# Altium project PCB_LLC_simplified.PrjPcb
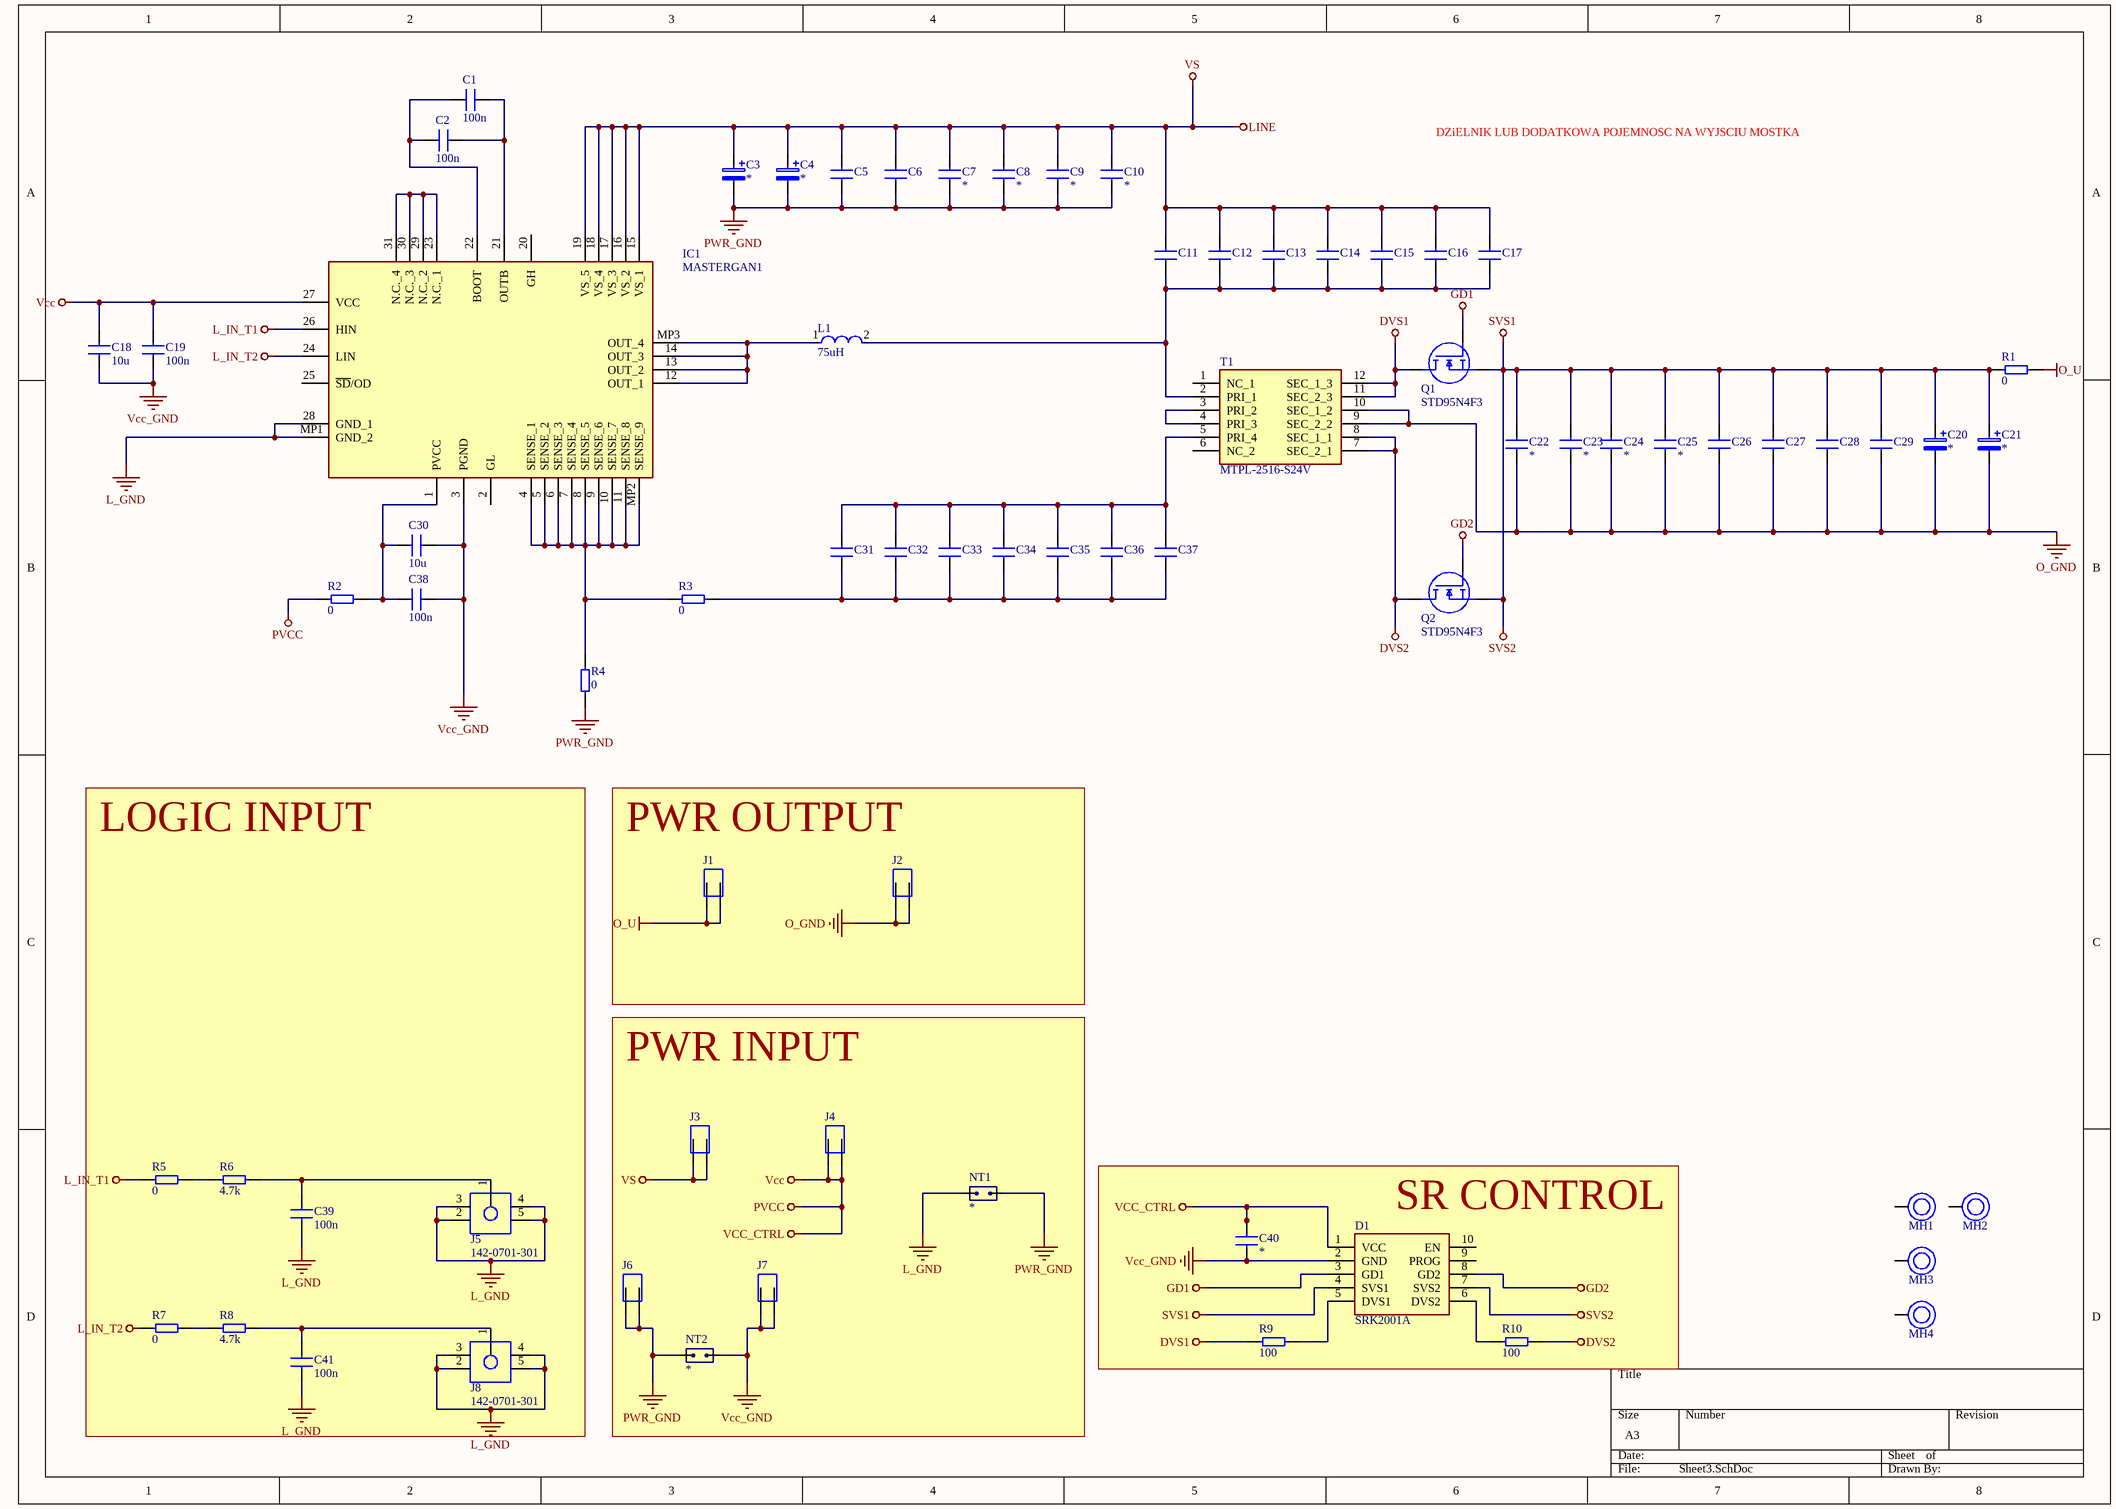
[diagram p0: Sheet3.SchDoc]
1 sheet, 71 parts. Net scope: global (net labels, ports and power ports of the same name join across sheets).
Board file: PCB1.PcbDoc

## Sheet Sheet3.SchDoc
size A3; SheetNumber: 1; SheetTotal: 1

### Parts
C1  100n  [Capcitor_1206]
C2  100n  [Capcitor_1206]
C3  *  [CAPPRD500W60D1300H2700]
C4  *  [CAPPRD500W60D1300H2700]
C5  620p  [Capcitor_1206]  (value not drawn)
C6  620p  [Capcitor_1206]  (value not drawn)
C7  *  [Capacitor_1812]
C8  *  [Capacitor_1812]
C9  *  [Capacitor_0805]
C10  *  [Capacitor_0805]
C11  620p  [Capcitor_1206]  (value not drawn)
C12  620p  [Capcitor_1206]  (value not drawn)
C13  620p  [Capcitor_1206]  (value not drawn)
C14  620p  [Capcitor_1206]  (value not drawn)
C15  620p  [Capcitor_1206]  (value not drawn)
C16  620p  [Capcitor_1206]  (value not drawn)
C17  620p  [Capcitor_1206]  (value not drawn)
C18  10u  [Capacitor_1812]
C19  100n  [Capcitor_1206]
C20  *  [Capacitor_Electrolytic_Vib_Res]
C21  *  [Capacitor_Electrolytic_Vib_Res]
C22  *  [Capacitor_0805]
C23  *  [Capacitor_0805]
C24  *  [Capacitor_0805]
C25  *  [Capacitor_0805]
C26  620p  [Capcitor_1206]  (value not drawn)
C27  620p  [Capcitor_1206]  (value not drawn)
C28  620p  [Capcitor_1206]  (value not drawn)
C29  620p  [Capcitor_1206]  (value not drawn)
C30  10u  [Capacitor_1812]
C31  620p  [Capcitor_1206]  (value not drawn)
C32  620p  [Capcitor_1206]  (value not drawn)
C33  620p  [Capcitor_1206]  (value not drawn)
C34  620p  [Capcitor_1206]  (value not drawn)
C35  620p  [Capcitor_1206]  (value not drawn)
C36  620p  [Capcitor_1206]  (value not drawn)
C37  620p  [Capcitor_1206]  (value not drawn)
C38  100n  [Capcitor_1206]
C39  100n  [Capcitor_1206]
C40  *  [Capacitor_0805]
C41  100n  [Capcitor_1206]
D1  SRK2001A  [SOIC127P600X175-8N]
IC1  MASTERGAN1  [MASTERGAN1]
J1  1289-STR  [1289STR]  (value not drawn)
J2  1289-STR  [1289STR]  (value not drawn)
J3  1289-STR  [1289STR]  (value not drawn)
J4  1289-STR  [1289STR]  (value not drawn)
J5  142-0701-301  [1420701301]
J6  1289-STR  [1289STR]  (value not drawn)
J7  1289-STR  [1289STR]  (value not drawn)
J8  142-0701-301  [1420701301]
L1  75uH  [FP-IHLP-4040ED-FP_3_175x4-MFG]
MH1  Mounting_Hole_M3  [Mounting_Hole_M3]  (value not drawn)  (no BOM)
MH2  Mounting_Hole_M3  [Mounting_Hole_M3]  (value not drawn)  (no BOM)
MH3  Mounting_Hole_M3  [Mounting_Hole_M3]  (value not drawn)  (no BOM)
MH4  Mounting_Hole_M3  [Mounting_Hole_M3]  (value not drawn)  (no BOM)
NT1  *  [Net tie]  (net tie, no BOM)
NT2  *  [Net tie]  (net tie, no BOM)
Q1  STD95N4F3  [STD95N4F3]
Q2  STD95N4F3  [STD95N4F3]
R1  0  [Resistor_1206]
R2  0  [Resistor_1206]
R3  0  [Resistor_1206]
R4  0  [Resistor_1206]
R5  0  [Resistor_1206]
R6  4.7k  [Resistor_1206]
R7  0  [Resistor_1206]
R8  4.7k  [Resistor_1206]
R9  100  [Resistor_1206]
R10  100  [Resistor_1206]
T1  MTPL-2516-S24V  [MTPL2516S24V]

### Blocks framed on the sheet
LOGIC INPUT: C39 C41 J5 J8 R5-R8
PWR OUTPUT: J1 J2
PWR INPUT: J3 J4 J6 J7 NT1 NT2
SR CONTROL: C40 D1 R9 R10

### Nets
DVS1: Q1.4(D) R9.1 T1.11(SEC_2_3) T1.12(SEC_1_3)
DVS2: Q2.4(D) R10.2 T1.7(SEC_2_1) T1.8(SEC_1_1)
GD1: D1.3(GD1) Q1.1(G)
GD2: D1.8(GD2) Q2.1(G)
L_GND: C39.2 C41.2 IC1.28(GND_1) IC1.MP1(GND_2) J5.2 J5.3 J5.4 J5.5 J8.2 J8.3 J8.4 J8.5 NT1.1
L_IN_T1: IC1.26(HIN) R5.2
L_IN_T2: IC1.24(LIN) R7.2
LINE: C3.1 C4.1 C5.2 C6.2 C7.2 C8.2 C9.2 C10.2 C11.2 C12.2 C13.2 C14.2 C15.2 C16.2 C17.2 IC1.15(VS_1) IC1.16(VS_2) IC1.17(VS_3) IC1.18(VS_4) IC1.19(VS_5) J3.1 J3.2  [also labelled VS]
O_GND: C20.2 C21.2 C22.1 C23.1 C24.1 C25.1 C26.1 C27.1 C28.1 C29.1 J2.1 J2.2 T1.9(SEC_2_2) T1.10(SEC_1_2)
O_U: J1.1 J1.2 R1.2
PVCC: C18.1 C19.1 C40.2 D1.1(VCC) IC1.27(VCC) J4.1 J4.2 R2.1  [also labelled Vcc, VCC_CTRL]
PWR_GND: C3.2 C4.2 C5.1 C6.1 C7.1 C8.1 C9.1 C10.1 J6.1 J6.2 NT1.2 NT2.1 R4.1
SVS1: C20.1 C21.1 C22.2 C23.2 C24.2 C25.2 C26.2 C27.2 C28.2 C29.2 D1.4(SVS1) D1.7(SVS2) Q1.3(S) Q2.3(S) R1.1  [also labelled SVS2]
Vcc_GND: C18.2 C19.2 C30.1 C38.2 C40.1 D1.2(GND) IC1.3(PGND) J7.1 J7.2 NT2.2
NetC1_1: C1.1 C2.1 IC1.22(BOOT)
NetC1_2: C1.2 C2.2 IC1.21(OUTB)
NetC11_1: C11.1 C12.1 C13.1 C14.1 C15.1 C16.1 C17.1 L1.2 T1.2(PRI_1)
NetC30_2: C30.2 C38.1 IC1.1(PVCC) R2.2
NetC31_1: C31.1 C32.1 C33.1 C34.1 C35.1 C36.1 C37.1 R3.2
NetC31_2: C31.2 C32.2 C33.2 C34.2 C35.2 C36.2 C37.2 T1.5(PRI_4)
NetC39_1: C39.1 J5.1 R6.1
NetC41_1: C41.1 J8.1 R8.1
NetD1_5: D1.5(DVS1) R9.2
NetD1_6: D1.6(DVS2) R10.1
NetIC1_4: IC1.4(SENSE_1) IC1.5(SENSE_2) IC1.6(SENSE_3) IC1.7(SENSE_4) IC1.8(SENSE_5) IC1.9(SENSE_6) IC1.10(SENSE_7) IC1.11(SENSE_8) IC1.MP2(SENSE_9) R3.1 R4.2
NetIC1_12: IC1.12(OUT_1) IC1.13(OUT_2) IC1.14(OUT_3) IC1.MP3(OUT_4) L1.1
NetIC1_23: IC1.23(N.C._1) IC1.29(N.C._2) IC1.30(N.C._3) IC1.31(N.C._4)
NetR5_1: R5.1 R6.2
NetR7_1: R7.1 R8.2
NetT1_3: T1.3(PRI_2) T1.4(PRI_3)

Not connected (* = marked no-connect by the designer): D1 9(PROG) 10(EN); IC1 2(GL) 20(GH) 25(~{SD}/OD); MH1 1; MH2 1; MH3 1; MH4 1; T1 1(NC_1) 6(NC_2)

### Notes on the sheet
- DZiELNIK LUB DODATKOWA POJEMNOSC NA WYJSCIU MOSTKA

### Library data of the parts
C1 C2 C5 C6 C11-C17 C19 C26-C29 C31-C39 C41 = Capacitor_1206: Capacitor - Standard SMD; Voltage: 35 V; MPN: *
  C1 C2 C19 C38 C39 C41: Capacitance: 100n
  C5 C6 C11-C17 C26-C29 C31-C37: Capacitance: 620p
C3 C4 = Capacitor_Electrolytic_THT: Capacitor - Electrolytic  THT; Capacitance: *; Voltage: *; MPN: *
C7 C8 C18 C30 = Capacitor_1812: Capacitor - Standard SMD; Voltage: *; MPN: *
  C7 C8: Capacitance: *
  C18 C30: Capacitance: 10u
C9 C10 C22-C25 C40 = Capacitor_0805: Capacitor - Standard SMD; Capacitance: *; Voltage: *; MPN: *
C20 C21 = Capacitor_Electrolytic_Vib_Res: Capacitor - Electrolytic  SMD; Capacitance: *; Voltage: *; MPN: *
D1 = SRK2001A: Diode; Manufacturer_Name: STMicroelectronics; Datasheet Link: https://componentsearchengine.com/Datasheets/1/SRK2001A.pdf; Height: 1.75mm; Manufacturer_Part_Number: SRK2001A; Mouser Part Number: 511-SRK2001A; Mouser Price/Stock: https://www.mouser.co.uk/ProductDetail/STMicroelectronics/SRK2001A?qs=aVyJF2WnouTzNJDK1aOmdg%3D%3D; Arrow Part Number: SRK2001A; Arrow Price/Stock: https://www.arrow.com/en/products/srk2001a/stmicroelectronics
IC1 = MASTERGAN1: Integrated Circuit; Manufacturer_Name: STMicroelectronics; Datasheet Link: https://www.mouser.com/datasheet/2/389/mastergan1-1893186.pdf; Height: 1mm; Manufacturer_Part_Number: MASTERGAN1; Mouser Part Number: 511-MASTERGAN1; Mouser Price/Stock: https://www.mouser.co.uk/ProductDetail/STMicroelectronics/MASTERGAN1?qs=hWgE7mdIu5TUQlvSzk235A%3D%3D; Arrow Part Number: MASTERGAN1; Arrow Price/Stock: https://www.arrow.com/en/products/mastergan1/stmicroelectronics?region=nac
J1-J4 J6 J7 = 1289-STR: Connector; Manufacturer_Name: Keystone Electronics; Datasheet Link: https://www.mouser.com/datasheet/2/215/Keystone_Electronics_12182018_1289-ST-1510776.pdf; Height: 14.37mm; Manufacturer_Part_Number: 1289-STR; Mouser Part Number: 534-1289-STR; Mouser Price/Stock: https://www.mouser.co.uk/ProductDetail/Keystone-Electronics/1289-STR?qs=0lSvoLzn4L%252BMUIbPVNHg8g%3D%3D
J5 J8 = 142-0701-301: Connector; Manufacturer_Name: Cinch Connectivity Solutions; Datasheet Link: https://datasheet.datasheetarchive.com/originals/distributors/Datasheets_SAMA/2ec9b041f970d014d2778887508fd87c.pdf; Height: 9.779mm; Manufacturer_Part_Number: 142-0701-301; Mouser Part Number: 530-142-0701-301; Mouser Price/Stock: https://www.mouser.co.uk/ProductDetail/Johnson-Cinch-Connectivity-Solutions/142-0701-301?qs=VqHsQWpF6un5h9kBF%252BTxDw%3D%3D; Arrow Part Number: 142-0701-301; Arrow Price/Stock: https://www.arrow.com/en/products/142-0701-301/cinch-connectivity-solutions?region=nac
L1 = CMP-02424-000499-1: Automotive Inductors, High Temperature (155 °C) Series 47uH 3.6A 127.87mΩ 20%
NT1 NT2 = Net tie: Value: *; HelpURL: *; MPN: *
Q1 Q2 = STD95N4F3: MOSFET (N-Channel); Manufacturer_Name: STMicroelectronics; Datasheet Link: https://www.st.com/resource/en/datasheet/std95n4f3.pdf; Height: 2.4mm; Manufacturer_Part_Number: STD95N4F3; Mouser Part Number: 511-STD95N4F3; Mouser Price/Stock: https://www.mouser.co.uk/ProductDetail/STMicroelectronics/STD95N4F3?qs=Djavi1aLnwoepdJqDxyf1g%3D%3D; Arrow Part Number: STD95N4F3; Arrow Price/Stock: https://www.arrow.com/en/products/std95n4f3/stmicroelectronics
R1-R10 = Resistor_1206: Resistor - Standard SMD; Power rate: *; MPN: *
  R1-R5 R7: Resistance: 0
  R6 R8: Resistance: 4.7k
  R9 R10: Resistance: 100
T1 = MTPL-2516-S24V: Transformer; Manufacturer_Name: Vishay; Datasheet Link: https://componentsearchengine.com/Datasheets/2/MTPL-2516-S24V.pdf; Height: 16.51mm; Manufacturer_Part_Number: MTPL-2516-S24V; Mouser Part Number: 70-MTPL-2516-S24V; Mouser Price/Stock: https://www.mouser.co.uk/ProductDetail/Vishay-Dale/MTPL-2516-S24V?qs=wd5RIQLrsJgVmtJW6evrjA%3D%3D